# EAGLE design LEDS (EAGLE 7.5.0)
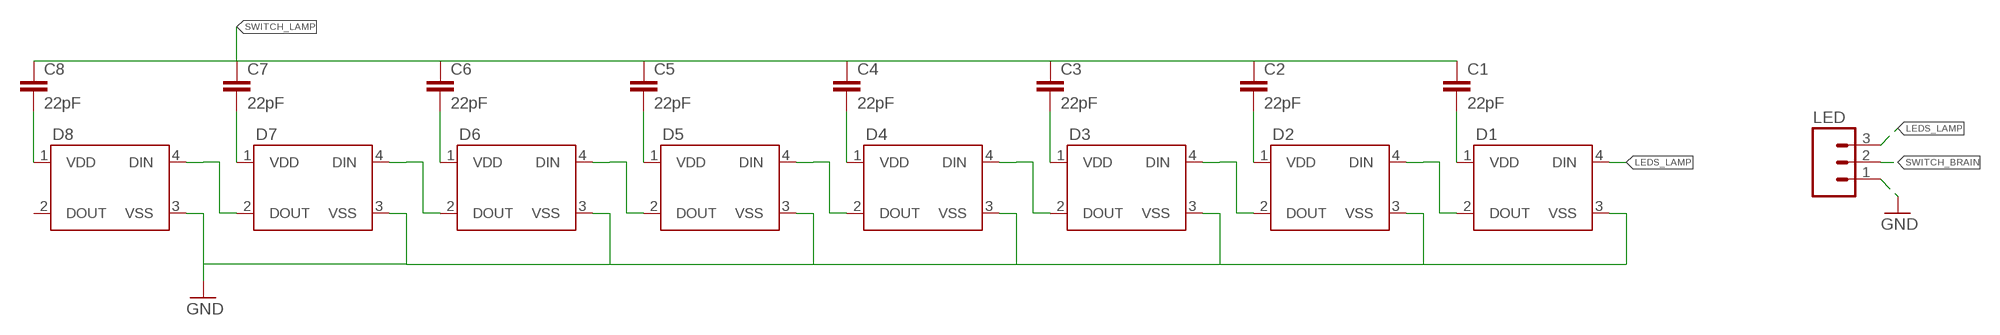
[diagram p0: schematic, sheet 1]

## Parts
C1  22pF  CAP1206  [1206]
C2  22pF  CAP1206  [1206]
C3  22pF  CAP1206  [1206]
C4  22pF  CAP1206  [1206]
C5  22pF  CAP1206  [1206]
C6  22pF  CAP1206  [1206]
C7  22pF  CAP1206  [1206]
C8  22pF  CAP1206  [1206]
D1  WS2812B  [WS2812B]
D2  WS2812B  [WS2812B]
D3  WS2812B  [WS2812B]
D4  WS2812B  [WS2812B]
D5  WS2812B  [WS2812B]
D6  WS2812B  [WS2812B]
D7  WS2812B  [WS2812B]
D8  WS2812B  [WS2812B]
LED  M03JST-PTH  [JST-3-PTH]

## Nets
GND: D1.3(VSS) D2.3(VSS) D3.3(VSS) D4.3(VSS) D5.3(VSS) D6.3(VSS) D7.3(VSS) D8.3(VSS) LED.1
LEDS_LAMP: D1.4(DIN) LED.3
N$10: D1.2(DOUT)
N$12: C1.2 D1.1(VDD)
N$13: D2.2(DOUT)
N$14: C2.2 D2.1(VDD)
N$16: D2.4(DIN)
N$17: D3.2(DOUT)
N$18: C3.2 D3.1(VDD)
N$20: D3.4(DIN)
N$21: D4.2(DOUT)
N$22: C4.2 D4.1(VDD)
N$24: D4.4(DIN)
N$25: D5.2(DOUT)
N$26: C5.2 D5.1(VDD)
N$28: D5.4(DIN)
N$29: D6.2(DOUT)
N$30: C6.2 D6.1(VDD)
N$32: D6.4(DIN)
N$33: D7.2(DOUT)
N$34: C7.2 D7.1(VDD)
N$36: D7.4(DIN)
N$38: C8.2 D8.1(VDD)
N$40: D8.4(DIN)
SWITCH_BRAIN: LED.2
SWITCH_LAMP: C1.1 C2.1 C3.1 C4.1 C5.1 C6.1 C7.1 C8.1
Unconnected: D8.2(DOUT)

## Library data of the parts
C1-C8 = SparkFun-Capacitors:CAP: Capacitor Standard 0603 ceramic capacitor, and 0.1" leaded capacitor.
D1-D8 = SparkFun-LED:WS2812B: WS2812B - Intelligent control LED integrated light source Technical Specifications: Power Supply Voltage (VDD): 3.5 to 5.3 V Input Voltage (VI): -0.5 to VDD+0.5 V Operating Junction Temperature (Topt): -25°C to +80°C Storage Temperature Range (Tstg): -55°C to +150°C; PROD_ID: DIO-12503
LED = SparkFun-Connectors:M03: Header 3 Standard 3-pin 0.1" header. Use with straight break away headers (SKU : PRT-00116), right angle break away headers (PRT-00553), swiss pins (PRT-00743), machine pins (PRT-00117), and female headers (PRT-00115). Molex polarized connector foot print use with SKU : PRT-08232 with associated crimp pins and housings.; SKU: PRT-09915

## Net classes
0 default: width 0.254 mm

## Board
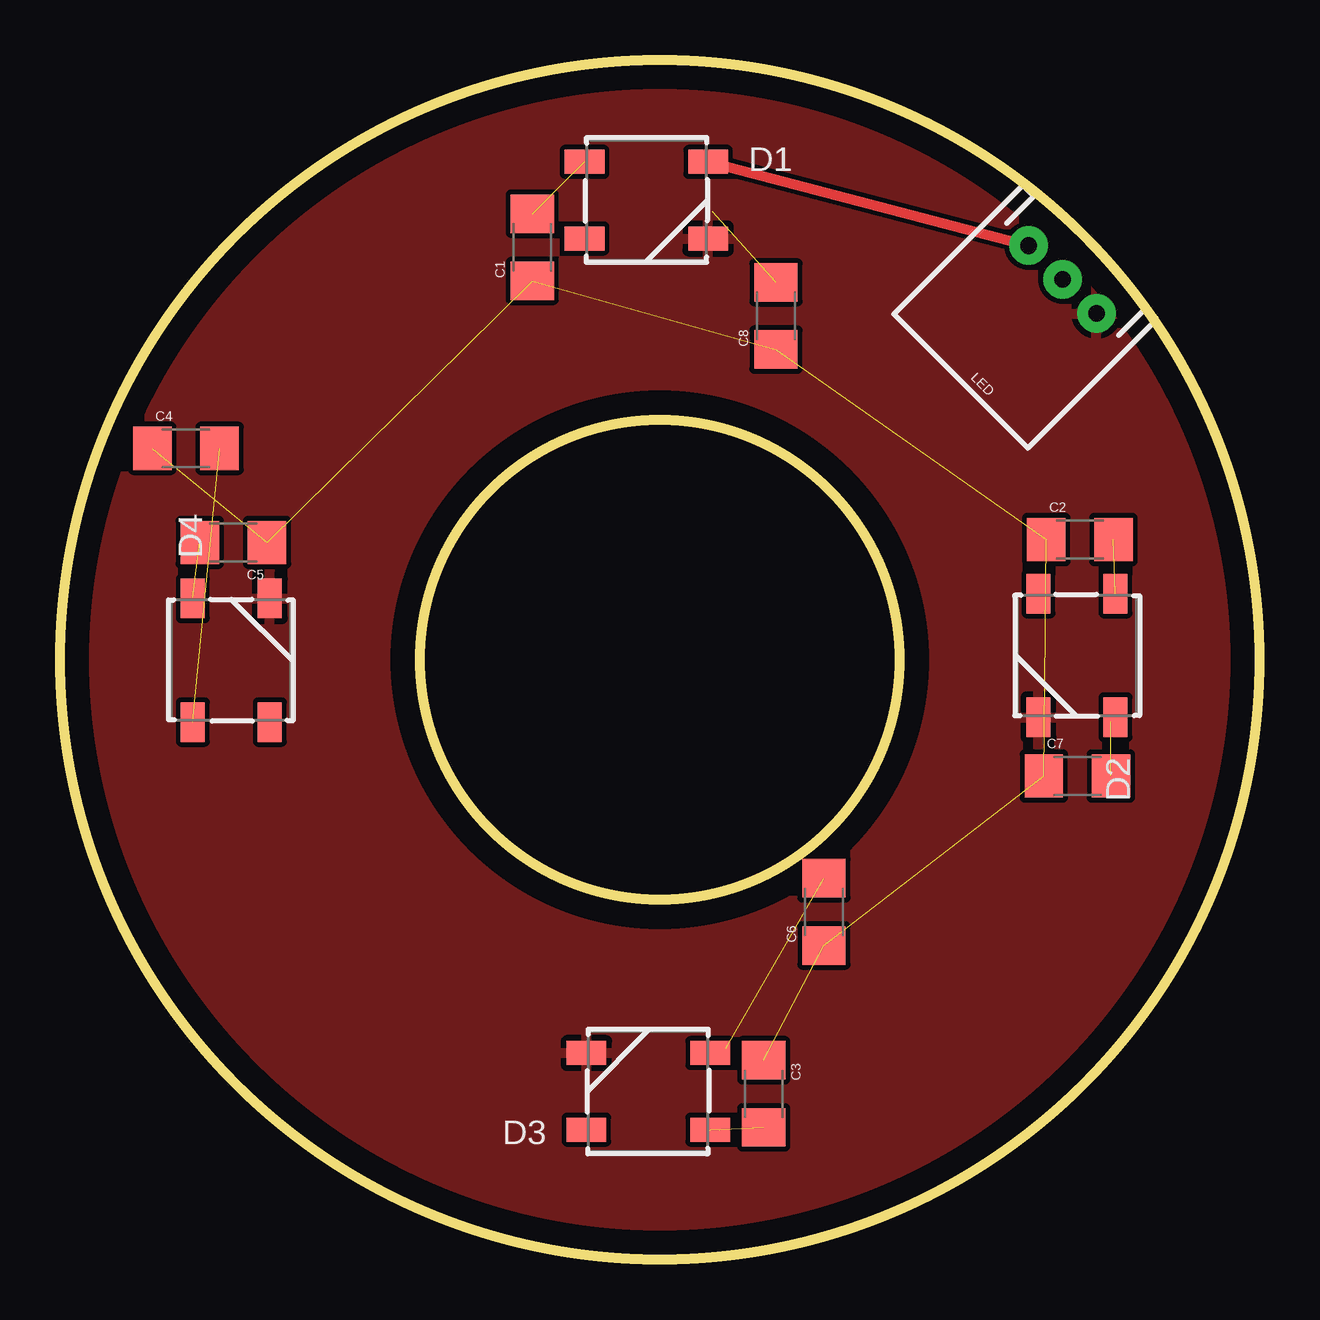
[diagram p1: board, top side]
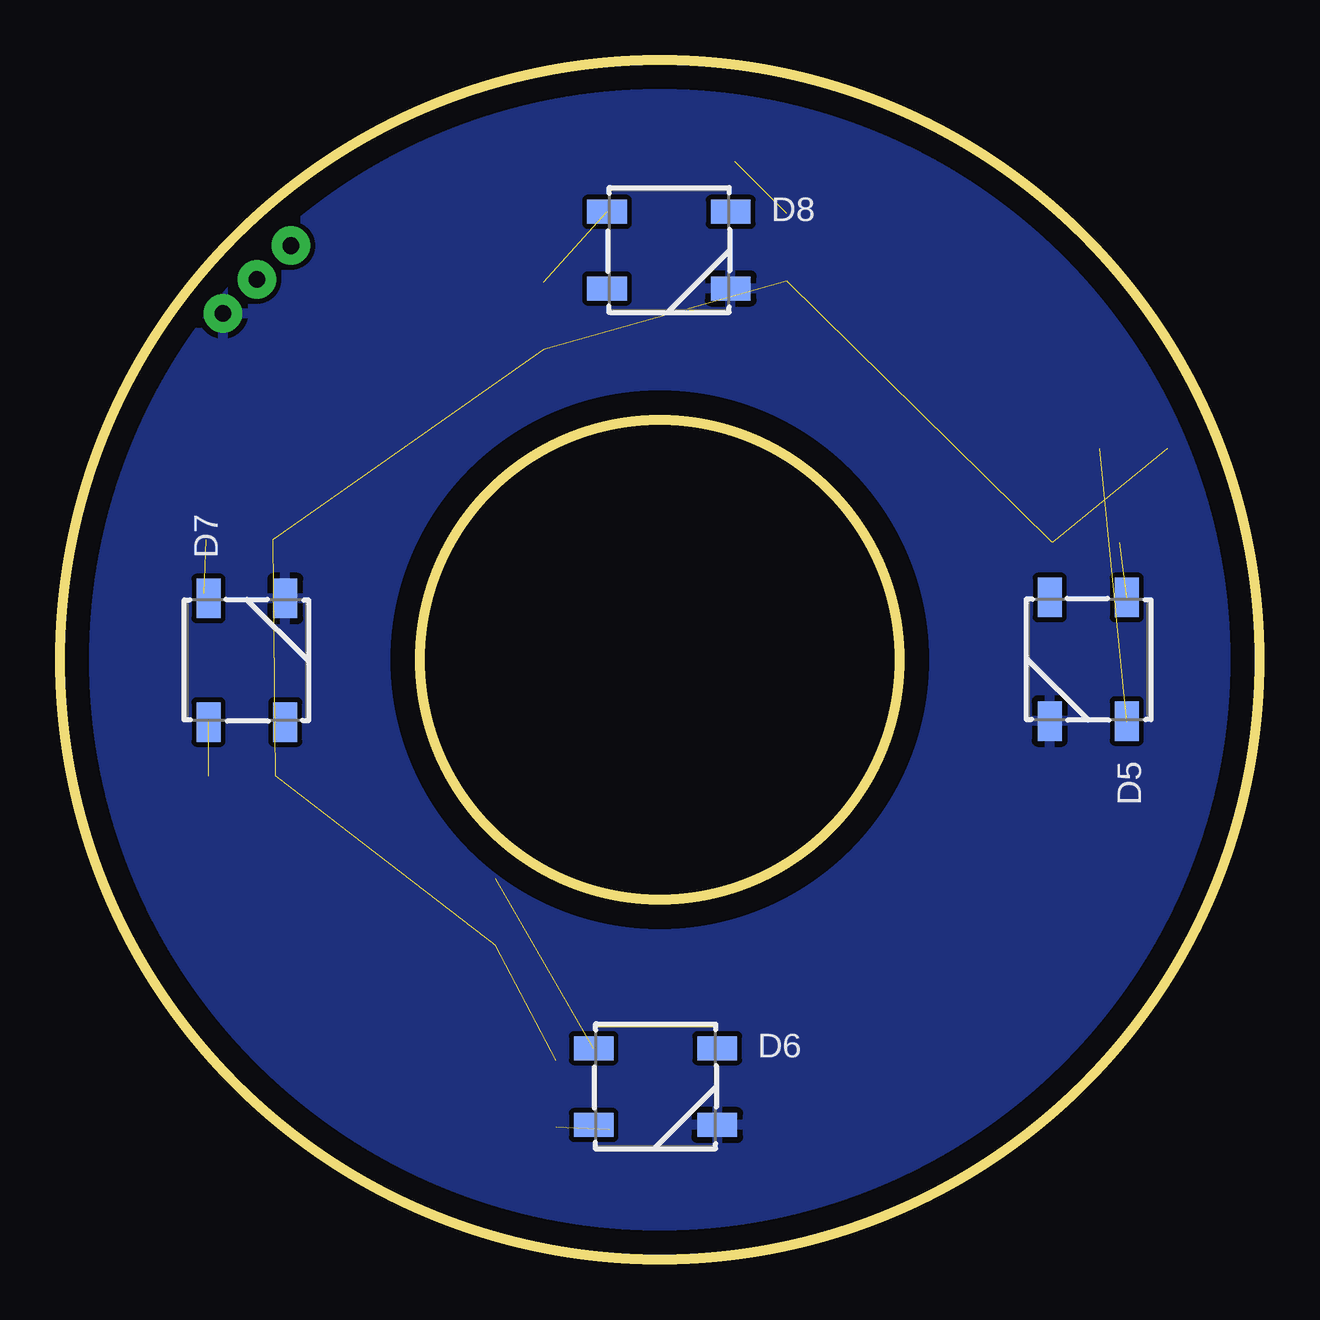
[diagram p2: board, bottom side, seen from below]

Size 50 x 50 mm. Coordinates in mm from the lower left corner, seen from the top.
Outline: circle at 25,25 radius 25
Outline: circle at 25,25 radius 10
Copper layers (1*16): Top 0.035mm / dielectric 1.5mm / Bottom 0.035mm
Design rules "default": minimum track width 10mil, minimum drill 24mil, track to track 8mil, track to pad 8mil, pad to pad 8mil, via to via 8mil, smd to smd 8mil, copper to edge 40mil, drill to drill 8mil, minimum pad ring 10mil, minimum via ring 8mil, stop-mask expansion 4mil, vias tented up to drill 0mil, thermal gap 10mil

### Footprints (pad centres in the part's own frame; a part is rotated, then mirrored left to right if it is on the bottom)
1206 = smd 1.6 x 1.8: 1 -1.4,0; 2 1.4,0
WS2812B = smd 1.651 x 1: 1 -2.577,1.6; 2 -2.577,-1.6; 3 2.577,-1.6; 4 2.577,1.6
JST-3-PTH = drill 0.7 pad 1.6: 1 -2,0; 2 0,0; 3 2,0

### Placement (x,y rotation side)
C1  19.69,42.19 90 top
C2  42.51,30.01 0 top
C3  29.33,6.91 270 top
C4  5.25,33.81 0 top
C5  7.23,29.89 180 top
C6  31.84,14.49 90 top
C7  42.41,20.16 0 top
C8  29.84,39.33 90 top
D1  24.44,44.16 0 top
D2  42.39,25.18 270 top
D3  24.52,7.01 180 top
D4  7.14,24.98 90 top
D5  7.14,25.02 270 bottom
D6  25.18,7.21 0 bottom
D7  42.21,24.98 90 bottom
D8  24.62,42.07 0 bottom
LED  41.79,40.85 135 top

### Tracks (layer width: path | path; a pad name or v marks a point on that pad's centre or on a via)
GND
  pour Top: -14,60 -14,-13 75,-13 75,-10 75,60
  pour Bottom: -9,-10 61,-10 61,65 -9,65
LEDS_LAMP
  Top 0.406: D1.4 LED.3
N$12  (1 unrouted)
N$14  (1 unrouted)
N$18  (1 unrouted)
N$22  (1 unrouted)
N$26  (1 unrouted)
N$30  (1 unrouted)
N$34  (1 unrouted)
N$38  (1 unrouted)
SWITCH_LAMP  (7 unrouted)